# Altium schematic sheet BMD_RevB_B6_INOUT.SchDoc: IN/OUT & MISC
size 401 x 291 mm; DocumentNumber: 2; SheetNumber: 6; SheetTotal: 6
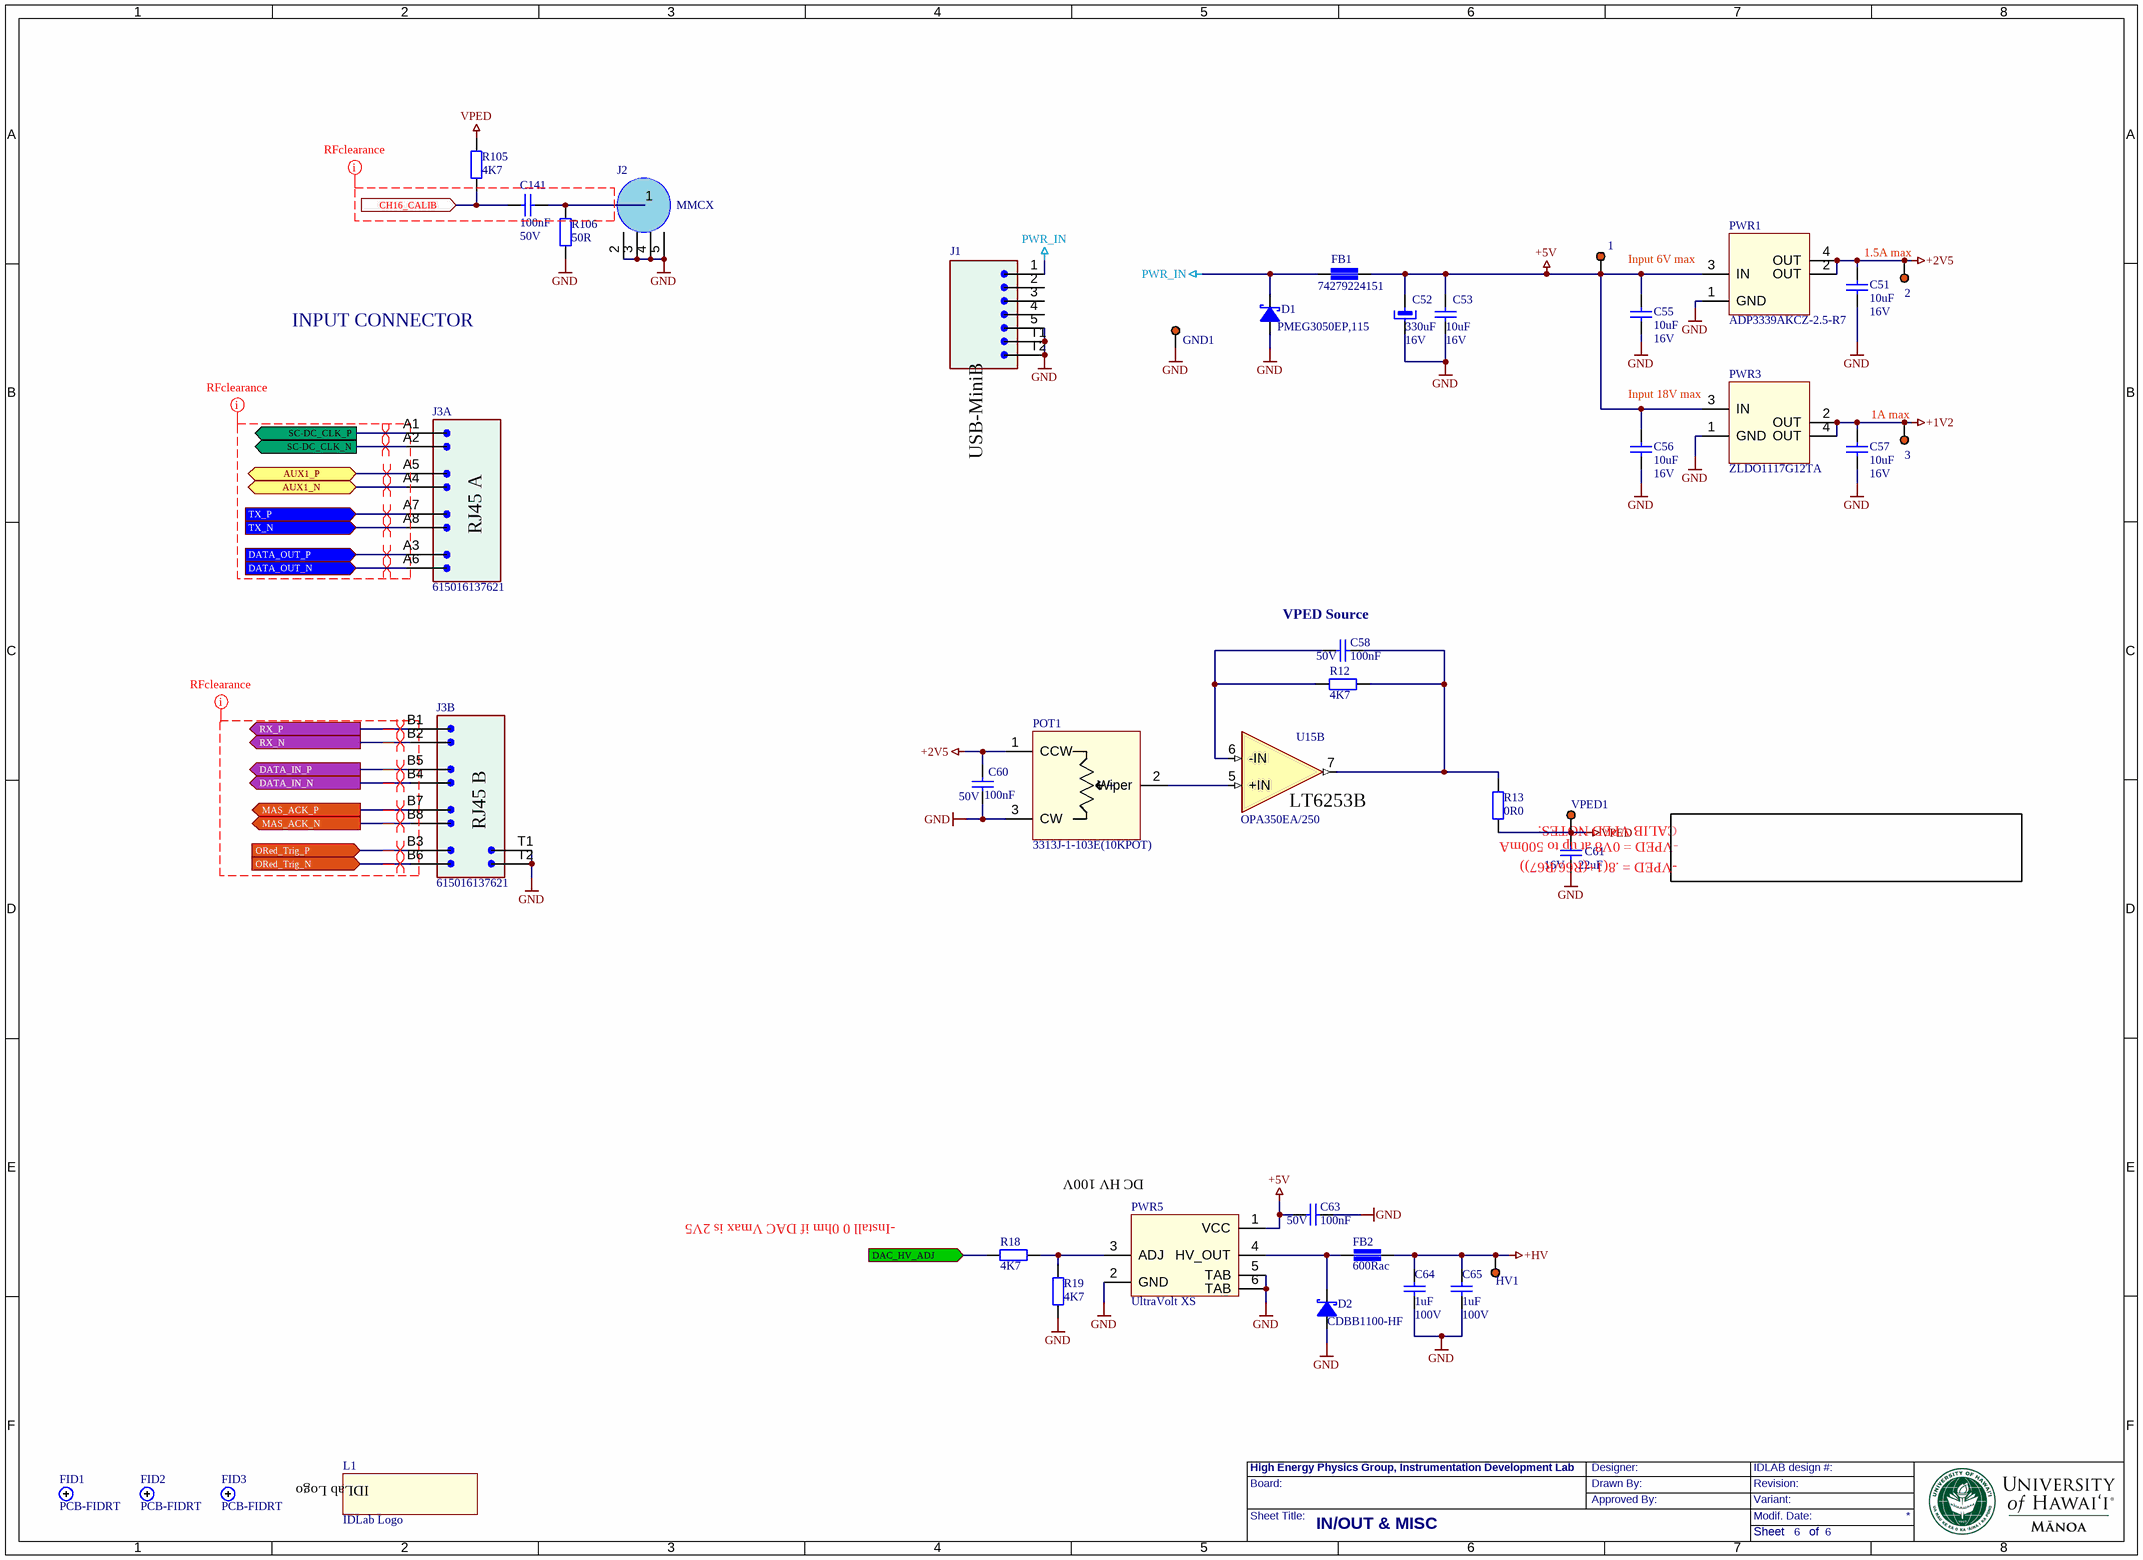
[diagram p0: BMD_RevB_B6_INOUT.SchDoc]

## Parts
1  SP1.5S  [SP1.5SQ]  (value not drawn)  (no BOM)
2  SP1.5S  [SP1.5SQ]  (value not drawn)  (no BOM)
3  SP1.5S  [SP1.5SQ]  (value not drawn)  (no BOM)
C51  10uF  Voltage rating: 16V  [CC1206N1R]
C52  330uF  Voltage rating: 16V  [CTC-D7343-43]
C53  10uF  Voltage rating: 16V  [CC1206N1R]
C55  10uF  Voltage rating: 16V  [CC1206N1R]
C56  10uF  Voltage rating: 16V  [CC1206N1R]
C57  10uF  Voltage rating: 16V  [CC1206N1R]
C58  100nF  Voltage rating: 50V  [CC0402N1R]
C60  100nF  Voltage rating: 50V  [CC0402N1R]
C61  22uF  Voltage rating: 16V  [CC0805N1R]
C63  100nF  Voltage rating: 50V  [CC0402N1R]
C64  1uF  Voltage rating: 100V  [CC1206N1R]
C65  1uF  Voltage rating: 100V  [CC1206N1R]
C141  100nF  Voltage rating: 50V  [CC0402N1R]
D1  PMEG3050EP,115  [SOD128]
D2  CDBB1100-HF  [DSMB-N]
FB1  74279224151  [FB2220N1R]
FB2  600Rac  [FB0603N1R]
FID1  PCB-FIDRT  [FIDRT50]  (net tie)
FID2  PCB-FIDRT  [FIDRT50]  (net tie)
FID3  PCB-FIDRT  [FIDRT50]  (net tie)
GND1  SP1.5S  [SP1.5SQ]  (value not drawn)  (no BOM)
HV1  SP1.5S  [SP1.5SQ]  (value not drawn)  (no BOM)
J1  0548190519  [USB_MINIB]  (value not drawn)
J2  MMCX  [MMCX_VERTICAL_THROUGH_HOLE]
J3  615016137621  [2X1 RJ45]  (parts A,B of 2)
L1  IDLab Logo  [IDLab logo]
POT1  3313J-1-103E(10KPOT)  [2KPOT]
PWR1  ADP3339AKCZ-2.5-R7  [SOT223]
PWR3  ZLDO1117G12TA  [SOT223]
PWR5  UltraVolt XS  [UltraVolt XS]
R12  4K7  [RC0402N1R]
R13  0R0  [RC0603N1R]
R18  4K7  [RC0402N1R]
R19  4K7  [RC0402N1R]
R105  4K7  [RC0402N1R]
R106  50R  [RC0402RF1]
U15  OPA350EA/250  [MSOP8N]  (part B of 2)
VPED1  SP1.5S  [SP1.5SQ]  (value not drawn)  (no BOM)

## Ports
AUX1_N (bidir), AUX1_P (bidir), CH16_CALIB (in), DAC_HV_ADJ (in), DATA_IN_N (out), DATA_IN_P (out), DATA_OUT_N (in), DATA_OUT_P (in), MAS_ACK_N (out), MAS_ACK_P (out), ORed_Trig_N (in), ORed_Trig_P (in), RX_N (out), RX_P (out), SC-DC_CLK_N (out), SC-DC_CLK_P (out), TX_N (in), TX_P (in)

## Nets
+1V2: 3.1 C57.2 PWR3.2(OUT) PWR3.4(OUT)
+2V5: 2.1 C51.2 C60.1 POT1.1(CCW) PWR1.2(OUT) PWR1.4(OUT)
+5V: 1.1 C52.1 C53.2 C55.2 C56.2 C63.2 FB1.2 PWR1.3(IN) PWR3.3(IN) PWR5.1(VCC)
+HV: C64.2 C65.2 FB2.2 HV1.1
GND: C51.1 C52.2 C53.1 C55.1 C56.1 C57.1 C60.2 C61.1 C63.1 C64.1 C65.1 D1.2(A) D2.2(A) GND1.1 J1.5 J1.T1 J1.T2 J2.2 J2.3 J2.4 J2.5 J3.T1 J3.T2 POT1.3(CW) PWR1.1(GND) PWR3.1(GND) PWR5.2(GND) PWR5.5(TAB) PWR5.6(TAB) R19.1 R106.1
PWR_IN: D1.1(C) FB1.1 J1.1
VPED: C61.2 R13.1 R105.2 VPED1.1
AUX1_N: J3.A4 ; port AUX1_N
AUX1_P: J3.A5 ; port AUX1_P
CH16_CALIB: C141.1 R105.1 ; port CH16_CALIB
DAC_HV_ADJ: R18.2 ; port DAC_HV_ADJ
DATA_IN_N: J3.B4 ; port DATA_IN_N
DATA_IN_P: J3.B5 ; port DATA_IN_P
DATA_OUT_N: J3.A6 ; port DATA_OUT_N
DATA_OUT_P: J3.A3 ; port DATA_OUT_P
MAS_ACK_N: J3.B8 ; port MAS_ACK_N
MAS_ACK_P: J3.B7 ; port MAS_ACK_P
ORed_Trig_N: J3.B6 ; port ORed_Trig_N
ORed_Trig_P: J3.B3 ; port ORed_Trig_P
RX_N: J3.B2 ; port RX_N
RX_P: J3.B1 ; port RX_P
SC-DC_CLK_N: J3.A2 ; port SC-DC_CLK_N
SC-DC_CLK_P: J3.A1 ; port SC-DC_CLK_P
TX_N: J3.A8 ; port TX_N
TX_P: J3.A7 ; port TX_P
NetC58_1: C58.1 R12.1 R13.2 U15.7(OUT)
NetC58_2: C58.2 R12.2 U15.6(-IN)
NetC141_2: C141.2 J2.1 R106.2
NetD2_1: D2.1(C) FB2.1 PWR5.4(HV_OUT)
NetPOT1_2: POT1.2(Wiper) U15.5(+IN)
NetPWR5_3: PWR5.3(ADJ) R18.1 R19.2

Not connected (* = marked no-connect by the designer): J1 2 3 4

## Layout directives
net class RF: (no net found under the mark)
differential pair: AUX1_N, AUX1_P, DATA_IN_N, DATA_IN_P, DATA_OUT_N, DATA_OUT_P, MAS_ACK_N, MAS_ACK_P, ORed_Trig_N, ORed_Trig_P, RX_N, RX_P, SC-DC_CLK_N, SC-DC_CLK_P, TX_N, TX_P

## Notes on the sheet
- Input 6V max
- 1.5A max
- INPUT CONNECTOR
- (near PWR3) Input 18V max
- (near 3) 1A max
- (near C58) VPED Source
- CALIB VPED NOTES:
- -VPED = .8(1+(R66/R67))
- -VPED = 0V8 at up to 500mA
- (near PWR5) -Install 0 0hm if DAC Vmax is 2V5
- (near PWR5) DC HV 100V
- Board:
- High Energy Physics Group, Instrumentation Development Lab
- Drawn By:
- Designer:
- Approved By:
- Revision:
- IDLAB design #:
- Variant:
- Sheet Title:
- Modif. Date:
- Sheet       of
- (in symbol 2x1 RJ45 CONN, part A) RJ45 A
- (in symbol 2x1 RJ45 CONN, part B) RJ45 B
- (in symbol OPAMP_LT6253CMS8, part B) LT6253B
- (in symbol USB Mini B CONN) USB-MiniB

## Library data of the parts
1-3 GND1 HV1 VPED1 = SP1.5S: Wire solder pin 1.5mm; Sort: 610; Tech: THDW; Price: 0
C51 C53 C55-C57 = CAPCC1206_10U_16VX7R: 10µF 16V Ceramic Capacitor X7R 1206; Manufacturer: TDK; Manufacturer No: C3216X7R1C106M160AC; Tech: SMDR; Package: Cap Chip 1206; Supplier 1: Digi-Key; Supplier Part Number 1: 445-1601-1-ND
C52 = CAPT7343_330U_16V: 330µF Molded Tantalum - Polymer Capacitors 16V; Manufacturer: Kemet; Manufacturer No: T521X337M016ATE050; Tech: SMDR; Package: Tant SMD D 7343-43; Supplier 1: Digi-Key; Supplier Part Number 1: 399-10365-6-ND
C58 C60 C63 C141 = CAPCC0402_100N_50VX7R: 0.10µF 50V Ceramic Capacitor X7R 0402; Manufacturer: TDK; Manufacturer No: C1005X7R1H104K050BB; Tech: SMDR; Package: Cap Chip 0402; Supplier 1: Digi-Key; Supplier Part Number 1: 445-5932-1-ND
C61 = CAPCC0805_22U_16VX7R: 22µF 16V Ceramic Capacitor X5R 0805; Manufacturer: Murata; Manufacturer No: GRM219R61C226ME15L; Tech: SMDR; Package: Cap Chip 0805; Supplier 1: Digi-Key; Supplier Part Number 1: 490-9952-1-ND
C64 C65 = CAPCC1206_1U_100VX7R: Capacitor chip ceramic 1206 100V X7R; Manufacturer: TDK; Manufacturer No: C3216X7R2A105K160AA; Tech: SMDR; Package: Cap Chip 1206; Supplier 1: Digi-Key; Supplier Part Number 1: 445-4467-1-ND; Supplier 2: Mouser; Supplier Part Number 2: 810-C3216X7R2A105K
D1 = Schottky_Diodes_5A_30V: DIODE SCHOTTKY 30V 5A SOD128  500ns 0.36Vf; Manufacturer: NXP; Tech: SMDR; Package: SMB; Manufacturer No: PMEG3050EP,115; Supplier 1: Digi-Key; Supplier Part Number 1: 568-6753-6-ND
D2 = Schottky_Diode_1A_100V: Schottky diode 1A 100V; Manufacturer: Comchip Technology; Tech: SMDR; Package: SMB; Manufacturer No: CDBB1100-HF; Supplier 1: Digi-Key; Supplier Part Number 1: 641-1709-1-ND
FB1 = FB2220-74279224151: Feritte filter smd 2220 5A 10mRdc 150Rac; Manufacturer: Wurth; Tech: SMDR; Manufacturer No: 74279224151; Package: Filter Chip 2220; Supplier 1: Digi-Key; Supplier Part Number 1: 732-3423-1-ND; Supplier 2: Mouser; Supplier Part Number 2: 710-74279224151
FB2 = FB0603-600R_0.2A: Feritte filter smd 0603 0.2A 1Rdc; Manufacturer: Murata; Manufacturer No: BLM18HG601SN1; Tech: SMDR; Package: Filter Chip 0603; Supplier 1: Digi-Key; Supplier Part Number 1: 490-1033-6-ND; Supplier 2: Newark; Supplier Part Number 2: 73M9104; Supplier 3: Mouser; Supplier Part Number 3: 81-BLM11HA601SG
FID1-FID3 = PCB-FIDRT: Fiducial top round open mask; Sort: 800; Tech: MECH; Price: 0
J1 = USB Mini B CONN: CONN USB RECEPTACLE 5POS RT ANG; Manufacturer: Molex, LLC; Tech: Through Hole, Right Angle; Manufacturer No: 0548190519; Package: USB - mini B; Supplier 1: Digi-Key; Supplier Part Number 1: WM17115-ND
J2 = MMCX: CONN MMCX JACK STR 50 OHM PCB; Manufacturer: Molex, LLC; Manufacturer part #: 0734151471; Cost: $3.10; Package size: MMCX; Supplier 1: Digi-Key; Supplier Part Number 1: WM5557-ND
J3 = 2x1 RJ45 CONN: CONN MOD JACK 8P8C R/A SHIELDED; Manufacturer: Wurth Electronics Inc.; Tech: Through Hole, Right Angle; Manufacturer No: 615016137621; Package: RJ45, Ethernet; Supplier 1: Digi-Key; Supplier Part Number 1: 732-2744-ND
POT1 = 3313J-1-103E(10KPOT): TRIMMER 10K OHM 0.125W SMD; Manufacturer: Bourns Inc.; cost: $2.08; Manufacturer part #: 3313J-1-103E; Package size: Rectangular - 0.138" x 0.126" Face x 0.087" H (3.50mm x 3.20mm x 2.20mm); Supplier 1: Digi-Key; Supplier Part Number 1: 3313J-103ECT-ND
PWR1 = 2V5 REG LDO: IC REG LDO 2.5V 1.5A SOT223-3; Manufacturer: Analog Devices Inc.; Tech: Surface Mount; Manufacturer No: ADP3339AKCZ-2.5-R7; Package: SOT-223-3/ ADP3339; Supplier 1: Digi-Key; Supplier Part Number 1: ADP3339AKCZ-2.5-R7CT-ND
PWR3 = 1V2 REG LDO: IC REG LDO 1.2V 1A SOT223-3; Manufacturer: Diodes Incorporated; Tech: Surface Mount; Manufacturer No: ZLDO1117G12TA; Supplier 1: Digi-Key; Supplier Part Number 1: ZLDO1117G12DICT-ND
PWR5 = UltraVolt_XS: DC-DC high-voltage power supply 100V; Manufacturer: Adavance Energy; Tech: Through hole; Manufacturer No: UltraVolt XS
R12 R18 R19 R105 = RES0402-4.7K-1%100PPM: RES SMD 4.7K OHM 1% 1/10W 0402; Manufacturer: Panasonic; Manufacturer No: ERJ-2RKF4701X; Tech: SMDR; Package: Res Chip 0402; Supplier 1: Digi-Key; Supplier Part Number 1: P4.70KLCT-ND
R13 = RES0603-0R0-1%100PPM: RES SMD 0.0OHM JUMPER 1/10W 0603; Manufacturer: Panasonic; Manufacturer No: ERJ-3GEY0R00V; Tech: SMDR; Package: Res Chip 0603; Supplier 1: Digi-Key; Supplier Part Number 1: P0.0GCT-ND
R106 = RES0402-50R-1%100PPM: RES SMD 49.9 OHM 1% 1/16W 0402; Manufacturer: Samsung Inc.; Manufacturer No: RC1005F49R9CS; Tech: SMDR; Package: Res Chip 0402; Supplier 1: Digi-Key; Supplier Part Number 1: 1276-3469-1-ND
U15 = OPAMP_LT6253CMS8: Single-Supply, Rail-to-Rail, 720MHZ; Manufacturer: Linear Technology/Analog Devices; Manufacturer No: LTC6253CMS8#PBF; Tech: SMDR; Package: MSOP8; Supplier 1: Digi-Key; Supplier Part Number 1: LTC6253CMS8#PBF-ND